# EAGLE schematic Carolo_31012020 (EAGLE 7.7.0)
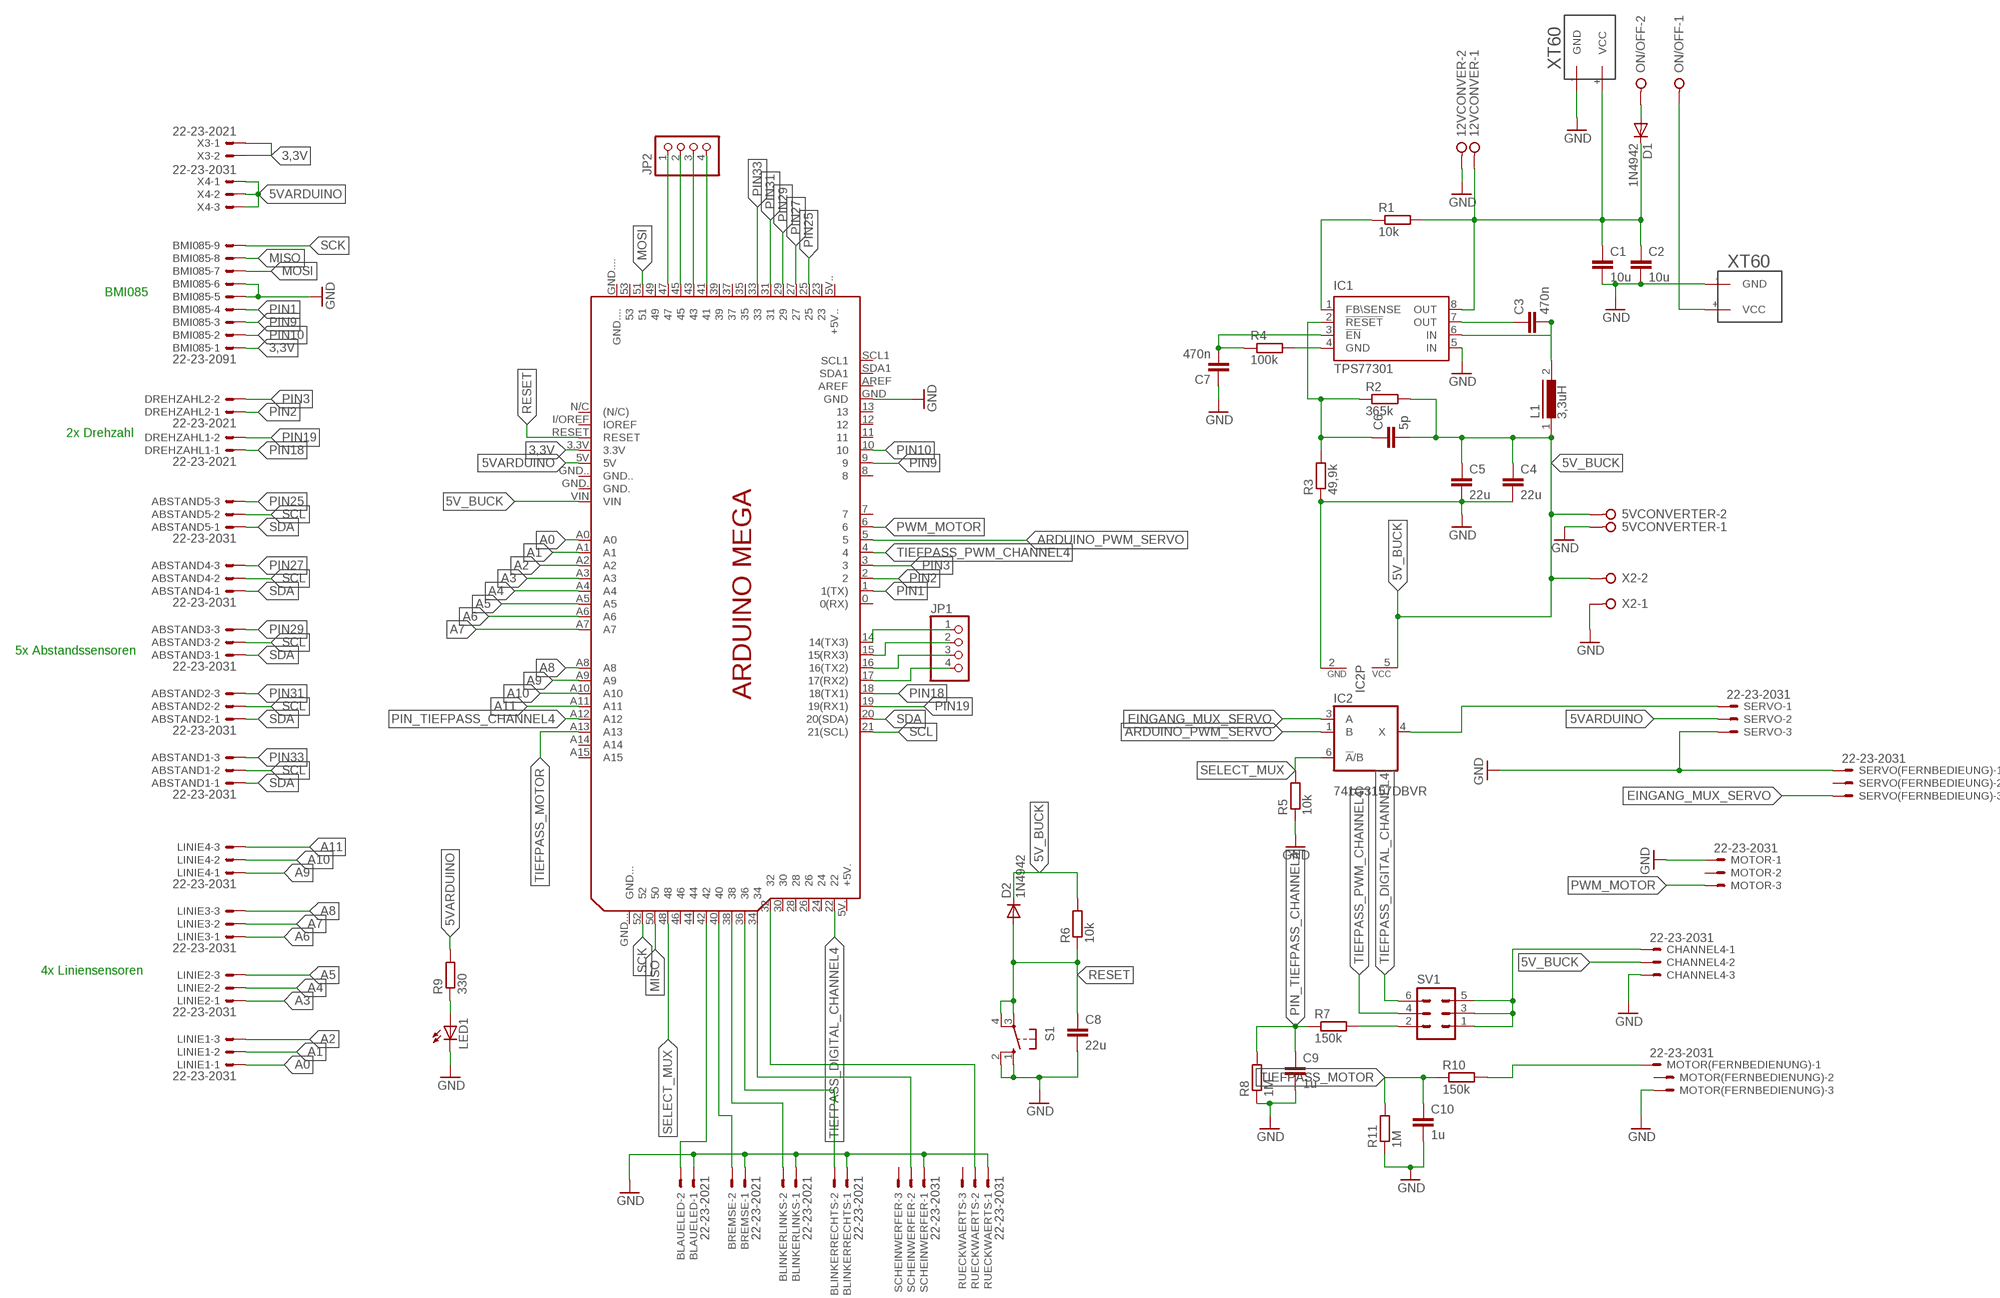
[diagram p0: schematic, sheet 1]

## Parts
5VCONVERTER  W237-02P  [W237-132]
12VCONVER  W237-02P  [W237-132]
ABSTAND1  22-23-2031  [22-23-2031]
ABSTAND2  22-23-2031  [22-23-2031]
ABSTAND3  22-23-2031  [22-23-2031]
ABSTAND4  22-23-2031  [22-23-2031]
ABSTAND5  22-23-2031  [22-23-2031]
BLAUELED  22-23-2021  [22-23-2021]
BLINKERLINKS  22-23-2021  [22-23-2021]
BLINKERRECHTS  22-23-2021  [22-23-2021]
BMI085  22-23-2091  [22-23-2091]
BREMSE  22-23-2021  [22-23-2021]
C1  10u  C2,5-3  [C2.5-3]
C2  10u  C2,5-3  [C2.5-3]
C3  470n  C2,5-3  [C2.5-3]
C4  22u  C2,5-3  [C2.5-3]
C5  22u  C2,5-3  [C2.5-3]
C6  5p  C2,5-3  [C2.5-3]
C7  470n  C2,5-3  [C2.5-3]
C8  22u  C2,5-3  [C2.5-3]
C9  1u  C2,5-3  [C2.5-3]
C10  1u  C2,5-3  [C2.5-3]
CHANNEL4  22-23-2031  [22-23-2031]
D1  1N4942  [DO41-10]
D2  1N4942  [DO41-10]
DREHZAHL1  22-23-2021  [22-23-2021]
DREHZAHL2  22-23-2021  [22-23-2021]
IC1  TPS77301  [SOP-08]
IC2  741G3157DBVR  [DBV_R-PDSO-G6]
JP1  PINHD-1X4  [1X04]
JP2  PINHD-1X4  [1X04]
L1  3,3uH  82114R  [82114R]
LED1  LED5MM  [LED5MM]
LINIE1  22-23-2031  [22-23-2031]
LINIE2  22-23-2031  [22-23-2031]
LINIE3  22-23-2031  [22-23-2031]
LINIE4  22-23-2031  [22-23-2031]
MOTOR  22-23-2031  [22-23-2031]
MOTOR(FERNBEDIENUNG)  22-23-2031  [22-23-2031]
ON/OFF  W237-02P  [W237-132]
PCB1  ARDUINO_MEGA  [ARDUINO_MEGA]
R1  10k  R-EU_0411/15  [0411/15]
R2  365k  R-EU_0411/15  [0411/15]
R3  49,9k  R-EU_0411/15  [0411/15]
R4  100k  R-EU_0411/15  [0411/15]
R5  10k  R-EU_0411/15  [0411/15]
R6  10k  R-EU_0411/15  [0411/15]
R7  150k  R-EU_0411/15  [0411/15]
R8  1M  R-EU_0411/15  [0411/15]
R9  330  R-EU_0411/15  [0411/15]
R10  150k  R-EU_0411/15  [0411/15]
R11  1M  R-EU_0411/15  [0411/15]
RUECKWAERTS  22-23-2031  [22-23-2031]
S1  10-XX  [B3F-10XX]
SCHEINWERFER  22-23-2031  [22-23-2031]
SERVO  22-23-2031  [22-23-2031]
SERVO(FERNBEDIEUNG)  22-23-2031  [22-23-2031]
SV1  ML6  [ML6]
U$1  XT60  [XT60]
U$2  XT60  [XT60]
X2  W237-02P  [W237-132]
X3  22-23-2021  [22-23-2021]
X4  22-23-2031  [22-23-2031]

## Nets
3,3V: BMI085.1 PCB1.3.3V X3.1 X3.2
5V_BUCK: 5VCONVERTER.2 C4.1 C5.1 C6.2 CHANNEL4.2 D2.C IC2.5(VCC) L1.1 PCB1.VIN R2.2 R6.2 X2.2
5VARDUINO: PCB1.5V R9.2 SERVO.2 X4.1 X4.2 X4.3
A0: LINIE1.1 PCB1.A0
A1: LINIE1.2 PCB1.A1
A2: LINIE1.3 PCB1.A2
A3: LINIE2.1 PCB1.A3
A4: LINIE2.2 PCB1.A4
A5: LINIE2.3 PCB1.A5
A6: LINIE3.1 PCB1.A6
A7: LINIE3.2 PCB1.A7
A8: LINIE3.3 PCB1.A8
A9: LINIE4.1 PCB1.A9
A10: LINIE4.2 PCB1.A10
A11: LINIE4.3 PCB1.A11
ARDUINO_PWM_SERVO: IC2.1(B) PCB1.5
EINGANG_MUX_SERVO: IC2.3(A) SERVO(FERNBEDIEUNG).3
GND: 5VCONVERTER.1 12VCONVER.2 BLAUELED.1 BLINKERLINKS.1 BLINKERRECHTS.1 BMI085.5 BMI085.6 BREMSE.1 C1.2 C2.2 C4.2 C5.2 C7.1 C8.2 C9.2 C10.2 CHANNEL4.3 IC1.5(IN) IC2.2(GND) LED1.K(C) MOTOR(FERNBEDIENUNG).3 MOTOR.1 PCB1.GND R3.1 R5.1 R8.1 R11.1 RUECKWAERTS.1 S1.1(S) S1.2(S1) SCHEINWERFER.1 SERVO(FERNBEDIEUNG).1 SERVO.3 U$1.-(GND) U$2.-(GND) X2.1
MISO: BMI085.8 PCB1.50
MOSI: BMI085.7 PCB1.51
N$1: ON/OFF.1 U$1.+(VCC)
N$2: IC2.4(X) SERVO.1
N$4: R7.2 SV1.2
N$5: C6.1 IC1.2(!RESET) R2.1 R3.2
N$6: C3.1 IC1.7(OUT)
N$8: CHANNEL4.1 SV1.1 SV1.3 SV1.5
N$9: PCB1.32 RUECKWAERTS.2
N$10: C3.2 IC1.6(IN) L1.2
N$12: C7.2 IC1.3(!EN) R4.1
N$14: PCB1.34 SCHEINWERFER.2
N$15: BLINKERRECHTS.2 PCB1.36
N$16: BLINKERLINKS.2 PCB1.38
N$17: LED1.A R9.1
N$18: BLAUELED.2 PCB1.42
N$19: BREMSE.2 PCB1.40
N$20: JP2.4 PCB1.41
N$23: IC1.4(GND) R4.2
N$24: D1.A ON/OFF.2
N$26: JP2.3 PCB1.43
N$27: 12VCONVER.1 C1.1 C2.1 D1.C IC1.8(OUT) R1.2 U$2.+(VCC)
N$28: MOTOR(FERNBEDIENUNG).1 R10.2
N$29: JP2.2 PCB1.45
N$30: JP2.1 PCB1.47
N$31: JP1.4 PCB1.17(17(RX2))
N$32: IC1.1(FB\SENSE) R1.1
N$33: JP1.3 PCB1.16(16(TX2))
N$34: JP1.2 PCB1.15(15(RX3))
N$35: JP1.1 PCB1.14(14(TX3))
PIN1: BMI085.4 PCB1.1(1(TX))
PIN2: DREHZAHL2.1 PCB1.2
PIN3: DREHZAHL2.2 PCB1.3
PIN9: BMI085.3 PCB1.9
PIN10: BMI085.2 PCB1.10
PIN18: DREHZAHL1.1 PCB1.18(18(TX1))
PIN19: DREHZAHL1.2 PCB1.19(19(RX1))
PIN25: ABSTAND5.3 PCB1.25
PIN27: ABSTAND4.3 PCB1.27
PIN29: ABSTAND3.3 PCB1.29
PIN31: ABSTAND2.3 PCB1.31
PIN33: ABSTAND1.3 PCB1.33
PIN_TIEFPASS_CHANNEL4: C9.1 PCB1.A12 R7.1 R8.2
PWM_MOTOR: MOTOR.3 PCB1.6
RESET: C8.1 D2.A PCB1.RESET R6.1 S1.3(P) S1.4(P1)
SCK: BMI085.9 PCB1.52
SCL: ABSTAND1.2 ABSTAND2.2 ABSTAND3.2 ABSTAND4.2 ABSTAND5.2 PCB1.21(21(SCL))
SDA: ABSTAND1.1 ABSTAND2.1 ABSTAND3.1 ABSTAND4.1 ABSTAND5.1 PCB1.20(20(SDA))
SELECT_MUX: IC2.6(!A!/B) PCB1.48 R5.2
TIEFPASS_DIGITAL_CHANNEL4: PCB1.22 SV1.6
TIEFPASS_MOTOR: C10.1 PCB1.A13 R10.1 R11.2
TIEFPASS_PWM_CHANNEL4: PCB1.4 SV1.4
Unconnected: MOTOR(FERNBEDIENUNG).2 MOTOR.2 PCB1.0(0(RX)) PCB1.5V.(+5V.) PCB1.5V..(+5V..) PCB1.7 PCB1.8 PCB1.11 PCB1.12 PCB1.13 PCB1.23 PCB1.24 PCB1.26 PCB1.28 PCB1.30 PCB1.35 PCB1.37 PCB1.39 PCB1.44 PCB1.46 PCB1.49 PCB1.53 PCB1.A14 PCB1.A15 PCB1.AREF PCB1.GND. PCB1.GND.. PCB1.GND... PCB1.GND.... PCB1.I/OREF(IOREF) PCB1.N/C((N/C)) PCB1.SCL1 PCB1.SDA1 RUECKWAERTS.3 SCHEINWERFER.3 SERVO(FERNBEDIEUNG).2

## Notes on the sheet
- BMI085
- 2x Drehzahl
- 5x Abstandssensoren
- 4x Liniensensoren

## Library data of the parts
5VCONVERTER 12VCONVER ON/OFF X2 = con-wago-508:W237-02P: WAGO SREW CLAMP; OC_FARNELL: unknown; OC_NEWARK: unknown
ABSTAND1-ABSTAND5 CHANNEL4 LINIE1-LINIE4 MOTOR MOTOR(FERNBEDIENUNG) RUECKWAERTS SCHEINWERFER SERVO SERVO(FERNBEDIEUNG) X4 = con-molex:22-23-2031: .100" (2.54mm) Center Header - 3 Pin; MF: MOLEX; MPN: 22-23-2031; OC_FARNELL: 1462950; OC_NEWARK: 30C0862
BLAUELED BLINKERLINKS BLINKERRECHTS BREMSE DREHZAHL1 DREHZAHL2 X3 = con-molex:22-23-2021: .100" (2.54mm) Center Header - 2 Pin; MF: MOLEX; MPN: 22-23-2021; OC_FARNELL: 1462926; OC_NEWARK: 25C3832
BMI085 = con-molex:22-23-2091: .100" (2.54mm) Center Header - 9 Pin; MF: MOLEX; MPN: 22-23-2091; OC_FARNELL: 1756827; OC_NEWARK: 56H0450
C1-C10 = capacitor-wima:C: CAPACITOR naming: grid - package width
D1 D2 = diode:1N4942: DIODE 1.0 A, 200 V, 150 ns
IC1 = texas:TPS773*: 250-mA LDO REGULATORS WITH RESET OUTPUT WITH 8-PIN MSOP PACKAGING Source: http://focus.ti.com/lit/ds/symlink/tps77333.pdf; MF: TEXAS INSTRUMENT CONNECTORS; MPN: TPS77301DGK; OC_FARNELL: 1510194; OC_NEWARK: 77C1213
IC2 = 74xx-little-us:74*1G3157: Single-Pole, Double-Throw Analog Switch Source: http://focus.ti.com/lit/ds/symlink/sn74lvc1g3157.pdf
JP1 JP2 = pinhead:PINHD-1X4: PIN HEADER
L1 = inductors:82114R: INDUCTOR
LED1 = led:LED: LED OSRAM: - CHIPLED LG R971, LG N971, LY N971, LG Q971, LY Q971, LO R971, LY R971 LH N974, LH R974 LS Q976, LO Q976, LY Q976 LO Q996 - Hyper CHIPLED LW Q18S LB Q993, LB Q99A, LB R99A - SideLED LS A670, LO A670, LY A670, LG A670, LP A670 LB A673, LV A673, LT A673, LW A673 LH A674 LY A675 LS A676, LA A676, LO A676, LY A676, LW A676 LS A679, LY A679, LG A679 - Hyper Micro SIDELED® LS Y876, LA Y876, LO Y876, LY Y876 LT Y87S - SmartLED LW L88C, LW L88S LB L89C, LB L89S, LG L890 LS L89K, LO L89K, LY L89K LS L896, LA L896, LO L896, LY L896 - TOPLED LS T670, LO T670, LY T670, LG T670, LP T670 LSG T670, LSP T670, LSY T670, LOP T670, LYG T670 LG T671, LOG T671, LSG T671 LB T673, LV T673, LT T673, LW T673 LH T674 LS T676, LA T676, LO T676, LY T676, LB T676, LH T676, LSB T676, LW T676 LB T67C, LV T67C, LT T67C, LS T67K, LO T67K, LY T67K, LW E67C LS E67B, LA E67B, LO E67B, LY E67B, LB E67C, LV E67C, LT E67C LW T67C LS T679, LY T679, LG T679 LS T770, LO T770, LY T770, LG T770, LP T770 LB T773, LV T773, LT T773, LW T773 LH T774 LS E675, LA E675, LY E675, LS T675 LS T776, LA T776, LO T776, LY T776, LB T776 LHGB T686 LT T68C, LB T68C - Hyper Mini TOPLED® LB M676 - Mini TOPLED Santana® LG M470 LS M47K, LO M47K, LY M47K Source: http://www.osram.convergy.de LUXEON: - LUMILED® LXK2-PW12-R00, LXK2-PW12-S00, LXK2-PW14-U00, LXK2-PW14-V00 LXK2-PM12-R00, LXK2-PM12-S00, LXK2-PM14-U00 LXK2-PE12-Q00, LXK2-PE12-R00, LXK2-PE12-S00, LXK2-PE14-T00, LXK2-PE14-U00 LXK2-PB12-K00, LXK2-PB12-L00, LXK2-PB12-M00, LXK2-PB14-N00, LXK2-PB14-P00, LXK2-PB14-Q00 LXK2-PR12-L00, LXK2-PR12-M00, LXK2-PR14-Q00, LXK2-PR14-R00 LXK2-PD12-Q00, LXK2-PD12-R00, LXK2-PD12-S00 LXK2-PH12-R00, LXK2-PH12-S00 LXK2-PL12-P00, LXK2-PL12-Q00, LXK2-PL12-R00 Source: www.luxeon.com KINGBRIGHT: KA-3528ASYC Source: www.kingbright.com
PCB1 = Arduino_:ARDUINO_MEGA: Device for representing an Arduino Mega board with a footprint in an EAGLE design. Created by Dave Young for Element14. More EAGLE documentation at: http://www.element14.com/community/community/knode/cadsoft_eagle
R1-R11 = resistor:R-EU_: RESISTOR, European symbol
S1 = switch-omron:10-XX: OMRON SWITCH; MPN: B3F-1000; OC_FARNELL: 176432; OC_NEWARK: 36M3542
SV1 = con-harting-ml:ML6: HARTING; OC_FARNELL: unknown; OC_NEWARK: unknown
U$1 U$2 = XT60:XT60: XT60